# Altium schematic sheet 10 IO-Connector.SchDoc: CM4 IO
size 420 x 297 mm; Page Create Date: March  8, 1995; Page Number: 10; Page Size: A3; Comment: radxa_1010; Page Count: 19; RevCode: V1.10; Doc: 10 IO-Connector; DsnPath: D:\WMS\黄工\[RC126]CM4_IO_V1.10\[RC126]_V1.10\CM4 IO_V1.10.DSN; SchematicName: CM4 IO V1.10; PageName: 10 IO-Connector; PageSize: A3; TopSchematic: True
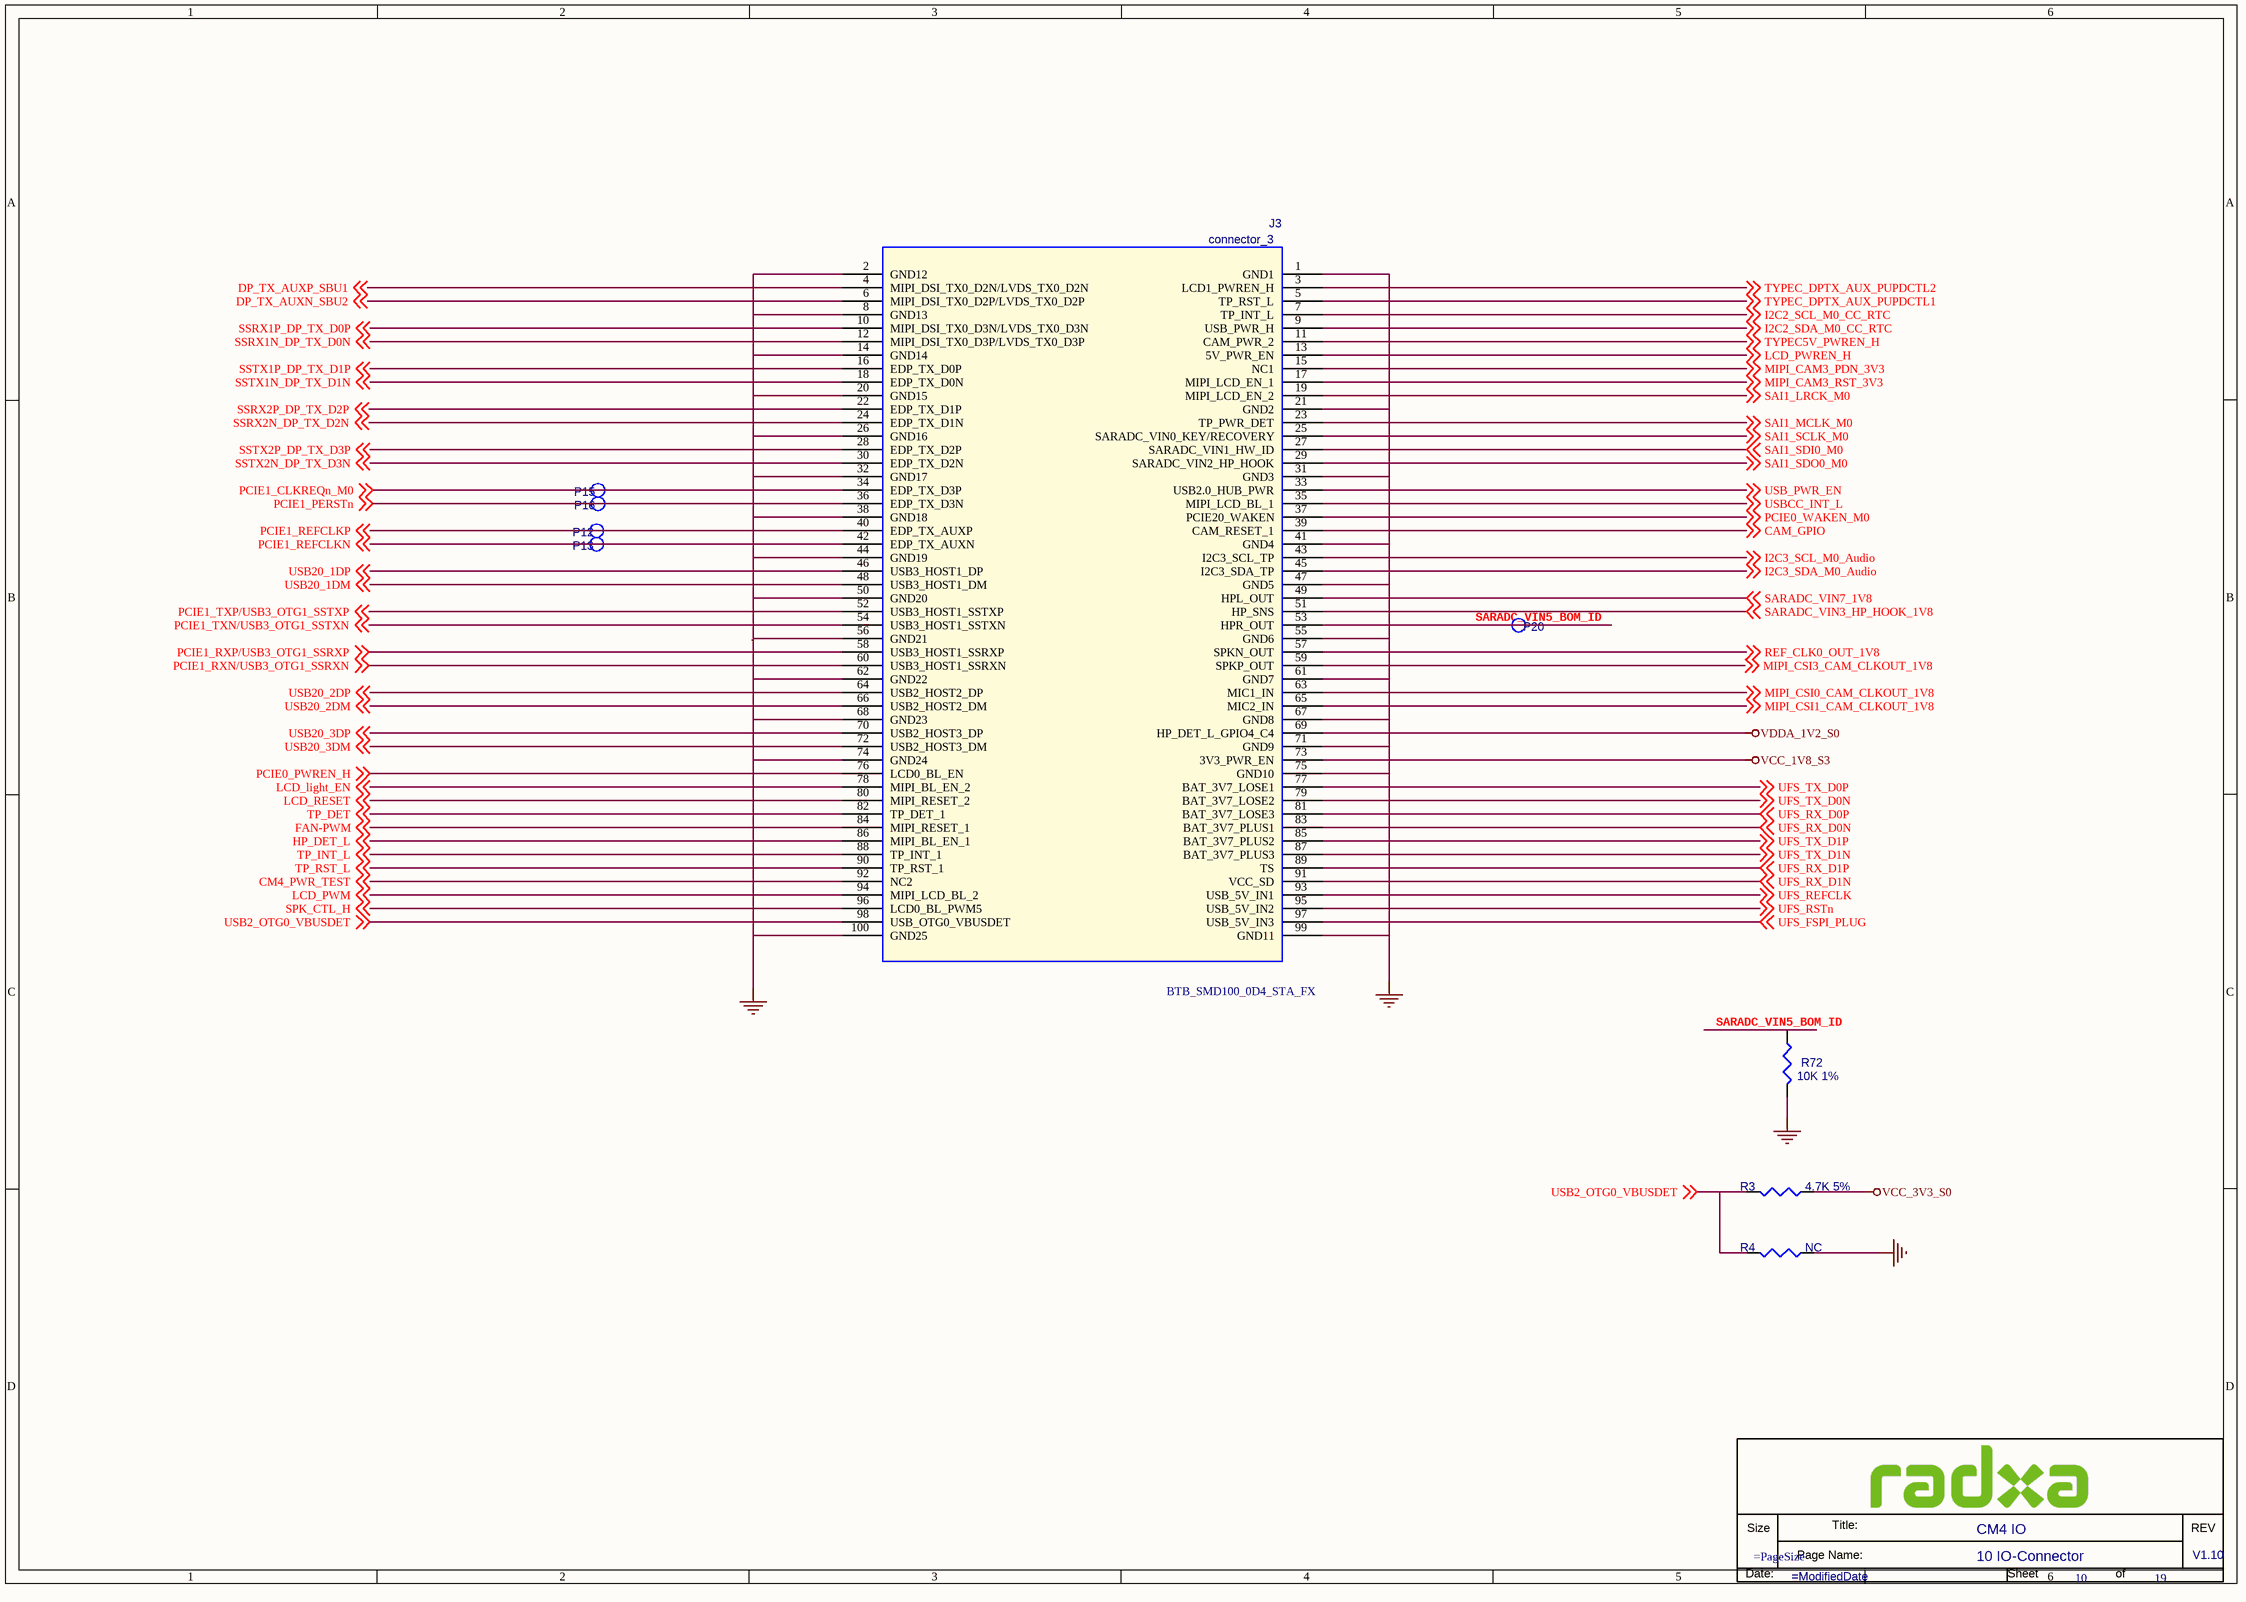
[diagram p0: 10 IO-Connector.SchDoc]

## Parts
*  Doc: 10 IO-Connector  RevCode: V1.10  Title: CM4 IO  Page Number: 10  Page Count: 19  (hidden comment: radxa_1010)  (graphical)
J3  connector_3  [BTB_SMD100_0D4_STA_FX]
P12  TEST  [TEST]  (value not drawn)
P13  TEST  [TEST]  (value not drawn)
P15  TEST  [TEST]  (value not drawn)
P16  TEST  [TEST]  (value not drawn)
P20  TEST  [TEST]  (value not drawn)
R3  4.7K 5%  [R0402]
R4  NC  [R0402]
R72  10K 1%  [R0402]

## Nets
GND: J3.1(GND1) J3.2(GND12) J3.8(GND13) J3.14(GND14) J3.20(GND15) J3.21(GND2) J3.26(GND16) J3.31(GND3) J3.32(GND17) J3.38(GND18) J3.41(GND4) J3.44(GND19) J3.47(GND5) J3.50(GND20) J3.55(GND6) J3.56(GND21) J3.61(GND7) J3.62(GND22) J3.67(GND8) J3.68(GND23) J3.71(GND9) J3.74(GND24) J3.75(GND10) J3.99(GND11) J3.100(GND25) R4.2 R72.2
VCC_1V8_S3: J3.73(3V3_PWR_EN)
VCC_3V3_S0: R3.2
VDDA_1V2_S0: J3.69(HP_DET_L_GPIO4_C4)
CAM_GPIO: J3.39(CAM_RESET_1) ; off-sheet CAM_GPIO
CM4_PWR_TEST: J3.92(NC2) ; off-sheet CM4_PWR_TEST
DP_TX_AUXN_SBU2: J3.6(MIPI_DSI_TX0_D2P/LVDS_TX0_D2P) ; off-sheet DP_TX_AUXN_SBU2
DP_TX_AUXP_SBU1: J3.4(MIPI_DSI_TX0_D2N/LVDS_TX0_D2N) ; off-sheet DP_TX_AUXP_SBU1
FAN-PWM: J3.84(MIPI_RESET_1) ; off-sheet FAN-PWM
HP_DET_L: J3.86(MIPI_BL_EN_1) ; off-sheet HP_DET_L
I2C2_SCL_M0_CC_RTC: J3.7(TP_INT_L) ; off-sheet I2C2_SCL_M0_CC_RTC
I2C2_SDA_M0_CC_RTC: J3.9(USB_PWR_H) ; off-sheet I2C2_SDA_M0_CC_RTC
I2C3_SCL_M0_Audio: J3.43(I2C3_SCL_TP) ; off-sheet I2C3_SCL_M0_Audio
I2C3_SDA_M0_Audio: J3.45(I2C3_SDA_TP) ; off-sheet I2C3_SDA_M0_Audio
LCD_light_EN: J3.78(MIPI_BL_EN_2) ; off-sheet LCD_light_EN
LCD_PWM: J3.94(MIPI_LCD_BL_2) ; off-sheet LCD_PWM
LCD_PWREN_H: J3.13(5V_PWR_EN) ; off-sheet LCD_PWREN_H
LCD_RESET: J3.80(MIPI_RESET_2) ; off-sheet LCD_RESET
MIPI_CAM3_PDN_3V3: J3.15(NC1) ; off-sheet MIPI_CAM3_PDN_3V3
MIPI_CAM3_RST_3V3: J3.17(MIPI_LCD_EN_1) ; off-sheet MIPI_CAM3_RST_3V3
MIPI_CSI0_CAM_CLKOUT_1V8: J3.63(MIC1_IN) ; off-sheet MIPI_CSI0_CAM_CLKOUT_1V8
MIPI_CSI1_CAM_CLKOUT_1V8: J3.65(MIC2_IN) ; off-sheet MIPI_CSI1_CAM_CLKOUT_1V8
MIPI_CSI3_CAM_CLKOUT_1V8: J3.59(SPKP_OUT) ; off-sheet MIPI_CSI3_CAM_CLKOUT_1V8
PCIE0_PWREN_H: J3.76(LCD0_BL_EN) ; off-sheet PCIE0_PWREN_H
PCIE0_WAKEN_M0: J3.37(PCIE20_WAKEN) ; off-sheet PCIE0_WAKEN_M0
PCIE1_CLKREQn_M0: J3.34(EDP_TX_D3P) P15.1 ; off-sheet PCIE1_CLKREQn_M0
PCIE1_PERSTn: J3.36(EDP_TX_D3N) P16.1 ; off-sheet PCIE1_PERSTn
PCIE1_REFCLKN: J3.42(EDP_TX_AUXN) P13.1 ; off-sheet PCIE1_REFCLKN
PCIE1_REFCLKP: J3.40(EDP_TX_AUXP) P12.1 ; off-sheet PCIE1_REFCLKP
PCIE1_RXN/USB3_OTG1_SSRXN: J3.60(USB3_HOST1_SSRXN) ; off-sheet PCIE1_RXN/USB3_OTG1_SSRXN
PCIE1_RXP/USB3_OTG1_SSRXP: J3.58(USB3_HOST1_SSRXP) ; off-sheet PCIE1_RXP/USB3_OTG1_SSRXP
PCIE1_TXN/USB3_OTG1_SSTXN: J3.54(USB3_HOST1_SSTXN) ; off-sheet PCIE1_TXN/USB3_OTG1_SSTXN
PCIE1_TXP/USB3_OTG1_SSTXP: J3.52(USB3_HOST1_SSTXP) ; off-sheet PCIE1_TXP/USB3_OTG1_SSTXP
REF_CLK0_OUT_1V8: J3.57(SPKN_OUT) ; off-sheet REF_CLK0_OUT_1V8
SAI1_LRCK_M0: J3.19(MIPI_LCD_EN_2) ; off-sheet SAI1_LRCK_M0
SAI1_MCLK_M0: J3.23(TP_PWR_DET) ; off-sheet SAI1_MCLK_M0
SAI1_SCLK_M0: J3.25(SARADC_VIN0_KEY/RECOVERY) ; off-sheet SAI1_SCLK_M0
SAI1_SDI0_M0: J3.27(SARADC_VIN1_HW_ID) ; off-sheet SAI1_SDI0_M0
SAI1_SDO0_M0: J3.29(SARADC_VIN2_HP_HOOK) ; off-sheet SAI1_SDO0_M0
SARADC_VIN3_HP_HOOK_1V8: J3.51(HP_SNS) ; off-sheet SARADC_VIN3_HP_HOOK_1V8
SARADC_VIN5_BOM_ID: J3.53(HPR_OUT) P20.1 R72.1
SARADC_VIN7_1V8: J3.49(HPL_OUT) ; off-sheet SARADC_VIN7_1V8
SPK_CTL_H: J3.96(LCD0_BL_PWM5) ; off-sheet SPK_CTL_H
SSRX1N_DP_TX_D0N: J3.12(MIPI_DSI_TX0_D3P/LVDS_TX0_D3P) ; off-sheet SSRX1N_DP_TX_D0N
SSRX1P_DP_TX_D0P: J3.10(MIPI_DSI_TX0_D3N/LVDS_TX0_D3N) ; off-sheet SSRX1P_DP_TX_D0P
SSRX2N_DP_TX_D2N: J3.24(EDP_TX_D1N) ; off-sheet SSRX2N_DP_TX_D2N
SSRX2P_DP_TX_D2P: J3.22(EDP_TX_D1P) ; off-sheet SSRX2P_DP_TX_D2P
SSTX1N_DP_TX_D1N: J3.18(EDP_TX_D0N) ; off-sheet SSTX1N_DP_TX_D1N
SSTX1P_DP_TX_D1P: J3.16(EDP_TX_D0P) ; off-sheet SSTX1P_DP_TX_D1P
SSTX2N_DP_TX_D3N: J3.30(EDP_TX_D2N) ; off-sheet SSTX2N_DP_TX_D3N
SSTX2P_DP_TX_D3P: J3.28(EDP_TX_D2P) ; off-sheet SSTX2P_DP_TX_D3P
TP_DET: J3.82(TP_DET_1) ; off-sheet TP_DET
TP_INT_L: J3.88(TP_INT_1) ; off-sheet TP_INT_L
TP_RST_L: J3.90(TP_RST_1) ; off-sheet TP_RST_L
TYPEC5V_PWREN_H: J3.11(CAM_PWR_2) ; off-sheet TYPEC5V_PWREN_H
TYPEC_DPTX_AUX_PUPDCTL1: J3.5(TP_RST_L) ; off-sheet TYPEC_DPTX_AUX_PUPDCTL1
TYPEC_DPTX_AUX_PUPDCTL2: J3.3(LCD1_PWREN_H) ; off-sheet TYPEC_DPTX_AUX_PUPDCTL2
UFS_FSPI_PLUG: J3.97(USB_5V_IN3) ; off-sheet UFS_FSPI_PLUG
UFS_REFCLK: J3.93(USB_5V_IN1) ; off-sheet UFS_REFCLK
UFS_RSTn: J3.95(USB_5V_IN2) ; off-sheet UFS_RSTn
UFS_RX_D0N: J3.83(BAT_3V7_PLUS1) ; off-sheet UFS_RX_D0N
UFS_RX_D0P: J3.81(BAT_3V7_LOSE3) ; off-sheet UFS_RX_D0P
UFS_RX_D1N: J3.91(VCC_SD) ; off-sheet UFS_RX_D1N
UFS_RX_D1P: J3.89(TS) ; off-sheet UFS_RX_D1P
UFS_TX_D0N: J3.79(BAT_3V7_LOSE2) ; off-sheet UFS_TX_D0N
UFS_TX_D0P: J3.77(BAT_3V7_LOSE1) ; off-sheet UFS_TX_D0P
UFS_TX_D1N: J3.87(BAT_3V7_PLUS3) ; off-sheet UFS_TX_D1N
UFS_TX_D1P: J3.85(BAT_3V7_PLUS2) ; off-sheet UFS_TX_D1P
USB2_OTG0_VBUSDET: J3.98(USB_OTG0_VBUSDET) R3.1 R4.1 ; off-sheet USB2_OTG0_VBUSDET
USB20_1DM: J3.48(USB3_HOST1_DM) ; off-sheet USB20_1DM
USB20_1DP: J3.46(USB3_HOST1_DP) ; off-sheet USB20_1DP
USB20_2DM: J3.66(USB2_HOST2_DM) ; off-sheet USB20_2DM
USB20_2DP: J3.64(USB2_HOST2_DP) ; off-sheet USB20_2DP
USB20_3DM: J3.72(USB2_HOST3_DM) ; off-sheet USB20_3DM
USB20_3DP: J3.70(USB2_HOST3_DP) ; off-sheet USB20_3DP
USB_PWR_EN: J3.33(USB2.0_HUB_PWR) ; off-sheet USB_PWR_EN
USBCC_INT_L: J3.35(MIPI_LCD_BL_1) ; off-sheet USBCC_INT_L

## Notes on the sheet
- (in symbol radxa_1010) Size; Title:; REV; Page Name:; Date:; Sheet; of

## Library data of the parts
J3 = BTB_0: SMD  公座  2*50PIN  180度  21.5*1.85*1.14mm  0.4mm脚距  黑色  DF40C-100DP-0.4V(51)  HRS(广濑)  ROHS; Part Reference: J3; Part Number: A1J01.00021; Temp Coeff: -35℃ to +85℃; Preferred: 6715f349cd0bc5; Value: connector_3; Part Type: 连接座; PCB Footprint: BTB_SMD100_0D4_STA_FX
P12 = TESTPOINT1: Part Reference: P12; PCB Footprint: TP_0R70; Value: TEST
P13 = TESTPOINT1: Part Reference: P13; PCB Footprint: TP_0R70; Value: TEST
P15 = TESTPOINT1: Part Reference: P15; PCB Footprint: TP_0R70; Value: TEST
P16 = TESTPOINT1: Part Reference: P16; PCB Footprint: TP_0R70; Value: TEST
P20 = TESTPOINT1: Part Reference: P20; PCB Footprint: TP_0R70; Value: TEST
R3 = R: SMD  0201  4.7K  1/20W  ±5%  ROHS; Part Reference: R3; Part Number: A1R01.00014; PCB Footprint: R0201; Temp Coeff: -55℃ to +125℃; Preferred: 6715f349cd0bc5; Value: 4.7K 5%; Part Type: 贴片电阻
R4 = R: SMD  0201  4.7K  1/20W  ±5%  ROHS; Part Reference: R4; Part Number: A1R01.00014; PCB Footprint: R0201; Temp Coeff: -55℃ to +125℃; Preferred: 6715f349cd0bc5; Value: NC; Part Type: 贴片电阻
R72 = R: SMD  0201  10K  1/20W  ±1%  ROHS; Part Reference: R72; Part Number: A1R01.00060; PCB Footprint: R0201; Temp Coeff: -55℃ to +125℃; Preferred: 6715f349cd0bc5; Value: 10K 1%; Part Type: 贴片电阻
* = radxa_1010: Page Create Date: March  8, 1995; Page Size: =PageSize; Page Modify Date: =ModifiedDate